# EAGLE design MCon_v1 (EAGLE 9.6.2)
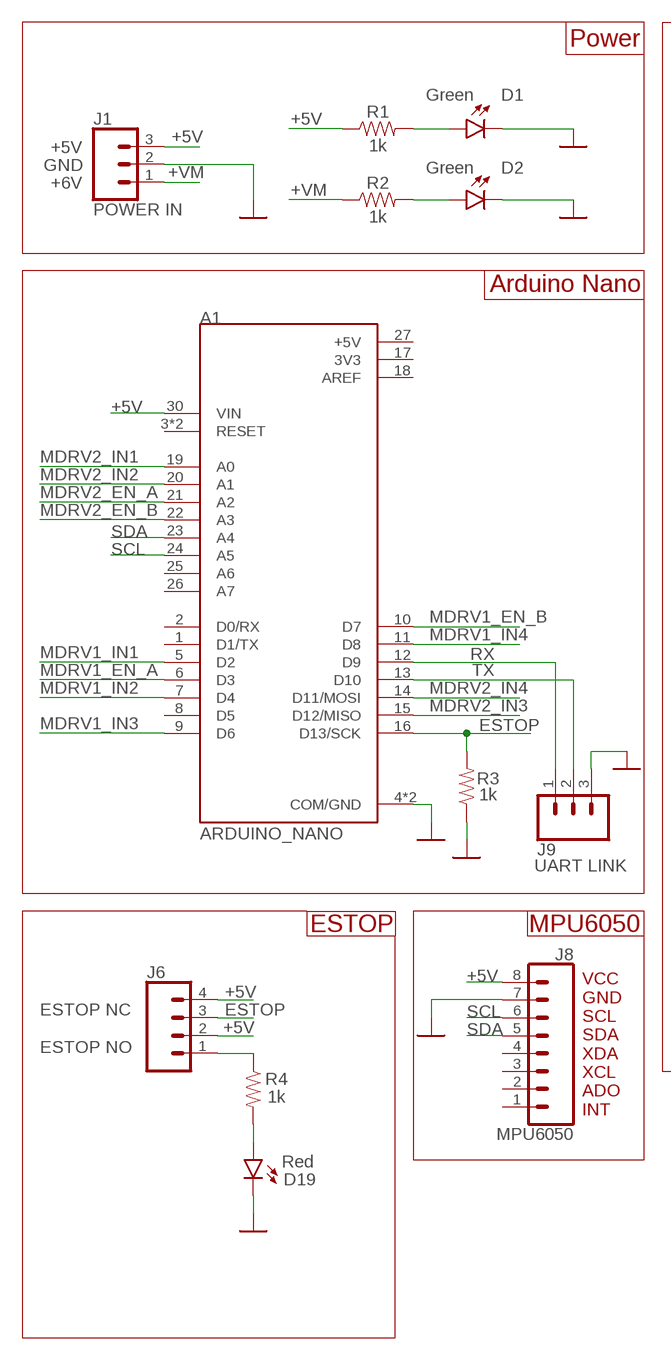
[diagram p0: schematic, sheet 1, part 1 of 2]
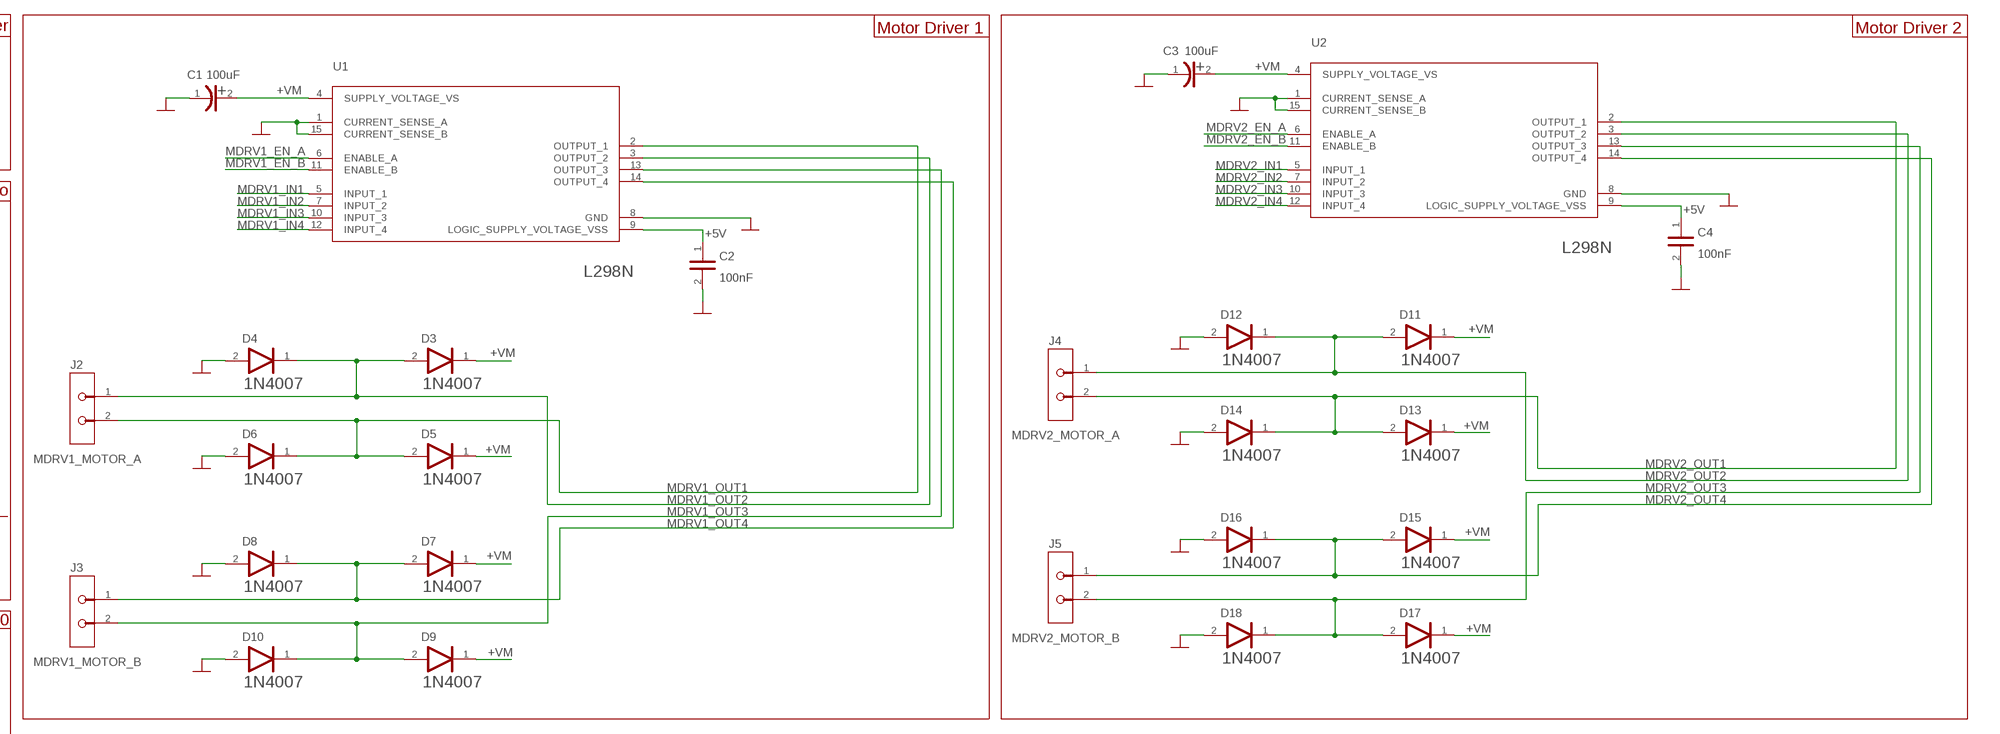
[diagram p1: schematic, sheet 1, part 2 of 2]

## Parts
A1  ARDUINO_NANO  [SHIELD_ARDUINO_NANO]
C1  100uF  PANASONIC_EEU-FR1C101PANASONIC_EEU-FR1C101_0_0  [PANASONIC_EEU-FR1C101_0]
C2  100nF  AVX_CK05BX104KAVX_CK05BX104K_0_0  [AVX_CK05BX104K_0]
C3  100uF  PANASONIC_EEU-FR1C101PANASONIC_EEU-FR1C101_0_0  [PANASONIC_EEU-FR1C101_0]
C4  100nF  AVX_CK05BX104KAVX_CK05BX104K_0_0  [AVX_CK05BX104K_0]
D1  Green  LED3MM  [LED_3MM]
D2  Green  LED3MM  [LED_3MM]
D3  DIOTEC_1N4007DIOTEC_1N4007_0_0  [DIOTEC_1N4007_0]
D4  DIOTEC_1N4007DIOTEC_1N4007_0_0  [DIOTEC_1N4007_0]
D5  DIOTEC_1N4007DIOTEC_1N4007_0_0  [DIOTEC_1N4007_0]
D6  DIOTEC_1N4007DIOTEC_1N4007_0_0  [DIOTEC_1N4007_0]
D7  DIOTEC_1N4007DIOTEC_1N4007_0_0  [DIOTEC_1N4007_0]
D8  DIOTEC_1N4007DIOTEC_1N4007_0_0  [DIOTEC_1N4007_0]
D9  DIOTEC_1N4007DIOTEC_1N4007_0_0  [DIOTEC_1N4007_0]
D10  DIOTEC_1N4007DIOTEC_1N4007_0_0  [DIOTEC_1N4007_0]
D11  DIOTEC_1N4007DIOTEC_1N4007_0_0  [DIOTEC_1N4007_0]
D12  DIOTEC_1N4007DIOTEC_1N4007_0_0  [DIOTEC_1N4007_0]
D13  DIOTEC_1N4007DIOTEC_1N4007_0_0  [DIOTEC_1N4007_0]
D14  DIOTEC_1N4007DIOTEC_1N4007_0_0  [DIOTEC_1N4007_0]
D15  DIOTEC_1N4007DIOTEC_1N4007_0_0  [DIOTEC_1N4007_0]
D16  DIOTEC_1N4007DIOTEC_1N4007_0_0  [DIOTEC_1N4007_0]
D17  DIOTEC_1N4007DIOTEC_1N4007_0_0  [DIOTEC_1N4007_0]
D18  DIOTEC_1N4007DIOTEC_1N4007_0_0  [DIOTEC_1N4007_0]
D19  Red  LED3MM  [LED_3MM]
J1  POWER IN  CONN_03  [1X03]
J2  MDRV1_MOTOR_A  TE_282837-2TE_282837-2_0_0  [TE_282837-2_0]
J3  MDRV1_MOTOR_B  TE_282837-2TE_282837-2_0_0  [TE_282837-2_0]
J4  MDRV2_MOTOR_A  TE_282837-2TE_282837-2_0_0  [TE_282837-2_0]
J5  MDRV2_MOTOR_B  TE_282837-2TE_282837-2_0_0  [TE_282837-2_0]
J6  CONN_04PTH  [1X04]
J8  MPU6050  CONN_08"  [1X08]
J9  UART LINK  CONN_03  [1X03]
R1  1k  RESISTORAXIAL-0.3  [AXIAL-0.3]
R2  1k  RESISTORAXIAL-0.3  [AXIAL-0.3]
R3  1k  RESISTORAXIAL-0.3  [AXIAL-0.3]
R4  1k  RESISTORAXIAL-0.3  [AXIAL-0.3]
U1  STMICROELECTRONICS_L298NSTMICROELECTRONICS_L298N_0_0  [STMICROELECTRONICS_L298N_0]
U2  STMICROELECTRONICS_L298NSTMICROELECTRONICS_L298N_0_0  [STMICROELECTRONICS_L298N_0]

## Nets
+5V: A1.30(VIN) C2.1 C4.1 J1.3 J6.2 J6.4 J8.8 R1.P$1 U1.9(LOGIC_SUPPLY_VOLTAGE_VSS) U2.9(LOGIC_SUPPLY_VOLTAGE_VSS)
+VM: C1.2(ANODE) C3.2(ANODE) D3.1(CATHODE) D5.1(CATHODE) D7.1(CATHODE) D9.1(CATHODE) D11.1(CATHODE) D13.1(CATHODE) D15.1(CATHODE) D17.1(CATHODE) J1.1 R2.P$1 U1.4(SUPPLY_VOLTAGE_VS) U2.4(SUPPLY_VOLTAGE_VS)
ESTOP: A1.16(D13/SCK) J6.3 R3.P$2
GND: A1.4(COM/GND) A1.29(COM/GND) C1.1(CATHODE) C2.2 C3.1(CATHODE) C4.2 D1.K(C) D2.K(C) D4.2(ANODE) D6.2(ANODE) D8.2(ANODE) D10.2(ANODE) D12.2(ANODE) D14.2(ANODE) D16.2(ANODE) D18.2(ANODE) D19.K(C) J1.2 J8.7 J9.3 R3.P$1 U1.1(CURRENT_SENSE_A) U1.8(GND) U1.15(CURRENT_SENSE_B) U2.1(CURRENT_SENSE_A) U2.8(GND) U2.15(CURRENT_SENSE_B) ; supply symbol labelled DGND
MDRV1_EN_A: A1.6(D3) U1.6(ENABLE_A)
MDRV1_EN_B: A1.10(D7) U1.11(ENABLE_B)
MDRV1_IN1: A1.5(D2) U1.5(INPUT_1)
MDRV1_IN2: A1.7(D4) U1.7(INPUT_2)
MDRV1_IN3: A1.9(D6) U1.10(INPUT_3)
MDRV1_IN4: A1.11(D8) U1.12(INPUT_4)
MDRV1_OUT1: D5.2(ANODE) D6.1(CATHODE) J2.2 U1.2(OUTPUT_1)
MDRV1_OUT2: D3.2(ANODE) D4.1(CATHODE) J2.1 U1.3(OUTPUT_2)
MDRV1_OUT3: D9.2(ANODE) D10.1(CATHODE) J3.2 U1.13(OUTPUT_3)
MDRV1_OUT4: D7.2(ANODE) D8.1(CATHODE) J3.1 U1.14(OUTPUT_4)
MDRV2_EN_A: A1.21(A2) U2.6(ENABLE_A)
MDRV2_EN_B: A1.22(A3) U2.11(ENABLE_B)
MDRV2_IN1: A1.19(A0) U2.5(INPUT_1)
MDRV2_IN2: A1.20(A1) U2.7(INPUT_2)
MDRV2_IN3: A1.15(D12/MISO) U2.10(INPUT_3)
MDRV2_IN4: A1.14(D11/MOSI) U2.12(INPUT_4)
MDRV2_OUT1: D13.2(ANODE) D14.1(CATHODE) J4.2 U2.2(OUTPUT_1)
MDRV2_OUT2: D11.2(ANODE) D12.1(CATHODE) J4.1 U2.3(OUTPUT_2)
MDRV2_OUT3: D17.2(ANODE) D18.1(CATHODE) J5.2 U2.13(OUTPUT_3)
MDRV2_OUT4: D15.2(ANODE) D16.1(CATHODE) J5.1 U2.14(OUTPUT_4)
N$1: D1.A R1.P$2
N$2: D2.A R2.P$2
N$3: J6.1 R4.P$1
N$4: D19.A R4.P$2
RX: A1.12(D9) J9.1
SCL: A1.24(A5) J8.6
SDA: A1.23(A4) J8.5
TX: A1.13(D10) J9.2
Unconnected: A1.1(D1/TX) A1.2(D0/RX) A1.3(RESET) A1.8(D5) A1.25(A6) A1.26(A7) A1.28(RESET) J8.1 J8.2 J8.3 J8.4

## Notes on the sheet
- Power | Motor Driver 1 | Motor Driver 2
- +5V
- GND
- +6V
- Arduino Nano
- ESTOP | MPU6050
- ESTOP NC
  
  ESTOP NO
- VCC
  GND
  SCL
  SDA
  XDA
  XCL
  ADO
  INT

## Power pins joined to a net without a drawn wire
3V3: A1.17(3V3)
+5V: A1.27(+5V)
AREF: A1.18(AREF)

## Library data of the parts
A1 = ARDUINO_NANO:ARDUINO_NANO: Arduino Nano, Through Hole Check prices <https://pricing.snapeda.com/parts/ARDUINO%20NANO/Arduino/view-part?ref=eda>; AVAILABILITY: In Stock; DESCRIPTION: ATmega4809 Arduino Nano Every with Headers AVR® AVR MCU 8-Bit Embedded Evaluation Board; MF: Arduino; MP: ARDUINO NANO; PACKAGE: None; PRICE: None
C1 C3 = RMDrv_100uF_FilCap_16SEPC100M:PANASONIC_EEU-FR1C101: Aluminum Electrolytic Capacitors (Radial Lead Type); CAPACITANCE: 100.0µF; CENTROID_NOT_SPECIFIED: No; DATASHEET: https://industrial.panasonic.com/cdbs/www-data/pdf/RDF0000/ABA0000C1259.pdf; DIGIKEY_DESCRIPTION: CAP 100µF 16V Aluminum Electrolytic Capacitors Radial, Can 5000 Hrs @ 105°C; DIGIKEY_PART_NUMBER: P14391-ND; LEAD_FREE: yes; MF: Panasonic; MOUSER_PART_NUMBER: 667-EEU-FR1C101; MPN: EEU-FR1C101; PACKAGE: RADIAL; PREFIX: C; ROHS: yes; TEMPERATURE_RANGE_HIGH: +105°C; TEMPERATURE_RANGE_LOW: 40°C; VOLTAGE: 16V
C2 C4 = RMDrv_0.1uF_FilCap_CK05BX104K:AVX_CK05BX104K: Multilayer Ceramic Capacitors; CAPACITANCE: 100.0nF; CENTROID_NOT_SPECIFIED: Yes; DATASHEET: http://datasheets.avx.com/CK05-06.pdf; DIGIKEY_DESCRIPTION: CAP 0.10µF ±10% 50V Ceramic Capacitor BX Radial; DIGIKEY_PART_NUMBER: 1010-1198-ND; IMPORTED_FROM: octopart; IPC_LAND_PATTERN_NAME: CAPRD508W85D483H483; LEAD_FREE: Unknown; MF: AVX; MOUNTING_TYPE: through hole; MOUSER_PART_NUMBER: 581-CK05BX104K; MPN: CK05BX104K; NUM_PINS: 2; PACKAGE: CAP_SMT_4MM83_2MM29; PREFIX: C; ROHS: Unknown; SYMBOL_0_0: Capacitor; TEMPERATURE_COEFFICIENT: BX; TEMPERATURE_RANGE_HIGH: +125°C; TEMPERATURE_RANGE_LOW: -55°C; TOLERANCE: ±10%; TYPE: capacitor; VOLTAGE: 50V
D1 D2 D19 = SparkFun-LED:LED: LED (Generic) Standard schematic elements and footprints for 5mm, 3mm, 1206, and 0603 sized LEDs. Generic LEDs with no color specified.; PROD_ID: DIO-08794
D3-D18 = 1N4007:DIOTEC_1N4007: Rectifier diode 1000 V 1 A DO-41, ,; AUTOMOTIVE: No; CAPACITANCE: 15pF; CENTROID_NOT_SPECIFIED: No; DATASHEET: https://datasheet.octopart.com/1N4007-Diotec-datasheet-62346875.pdf; DEVICE_CLASS_L1: Discrete Semiconductors; DEVICE_CLASS_L2: Diodes; DEVICE_CLASS_L3: Rectifier Diodes; FOOTPRINT_PARAMETERS_0: {"fp_type":"Axial","params":{"N":{"long name":"Number of leads","type":"fixed","short name":"N","value":2},"L":{"nom":false,"long name":"Package length","min":false,"max":5200000,"short name":"L","type":"measurement"},"D":{"nom":false,"long name":"Package diameter","min":false,"max":2800000,"short name":"D","type":"measurement"},"d":{"nom":770000,"long name":"Lead diameter","min":700000,"max":840000,"short name":"d","type":"measurement"},"e":{"nom":8880000,"long name":"Lead spacing","min":null,"max":null,"short name":"e","type":"measurement"},"P":{"default":"false","long name":"Polarized","type":"multichoice","short name":"P"},"offset x":{"nom":0,"long name":"X Center offset","min":null,"max":null,"short name":"offset x","type":"measurement"},"offset y":{"nom":0,"long name":"Y Center offset","min":null,"max":null,"short name":"offset y","type":"measurement"},"LS":{"default":"Circle","long name":"Land shape","type":"multichoice","short name":"LS"},"LS1":{"default":"Square","long name":"Land shape (Pin 1)","type":"multichoice","short name":"LS1"}}}; FOOTPRINT_VARIANT_NAME_0: Recommended_Land_Pattern; FORWARD_CURRENT: 1A; HEIGHT: 2.8mm; IPC_LAND_PATTERN_NAME: DIOAD888W100L520D280; LEAD_FREE: Yes; MAX_JUNCTION_TEMP: +175°C; MAX_REPETITIVE_REVERSE_VOLTAGE: 1000V; MAX_SURGE_FORWARD_CURRENT: 27A; MF: Diotec; MFG_PACKAGE_IDENT: 1N4007; MFG_PACKAGE_IDENT_DATE: 0; MFG_PACKAGE_IDENT_REV: 0; MPN: 1N4007; PACKAGE: AXIAL; PEAK_REVERSE_CURRENT: 5uA; PREFIX: D; REVERSE_VOLTAGE: 1000V; ROHS: Yes; TEMPERATURE_RANGE_HIGH: +175°C; TEMPERATURE_RANGE_LOW: -50°C; VERIFICATION_VERSION: 0.0.0.3
J1 J9 = SparkFun-Connectors:CONN_03: Multi connection point. Often used as Generic Header-pin footprint for 0.1 inch spaced/style header connections On any of the 0.1 inch spaced packages, you can populate with these: Break Away Headers - Straight <https://www.sparkfun.com/products/116> (PRT-00116) Break Away Male Headers - Right Angle <https://www.sparkfun.com/products/553> (PRT-00553) Female Headers <https://www.sparkfun.com/products/115> (PRT-00115) Break Away Headers - Machine Pin <https://www.sparkfun.com/products/117> (PRT-00117) Break Away Female Headers - Swiss Machine Pin <https://www.sparkfun.com/products/743> (PRT-00743) Stackable Header - 3 Pin (Female, 0.1") <https://www.sparkfun.com/products/13875> (PRT-13875) For SCREWTERMINALS and SPRING TERMINALS visit here: Screw Terimnals on SparkFun.com <https://www.sparkfun.com/search/results?term=Screw+Terminals> (5mm/3.5mm/2.54mm spacing) This device is also useful as a general connection point to wire up your design to another part of your project. Our various solder wires solder well into these plated through hole pads. Hook-Up Wire - Assortment (Stranded, 22 AWG) <https://www.sparkfun.com/products/11375> (PRT-11375) Hook-Up Wire - Assortment (Solid Core, 22 AWG) <https://www.sparkfun.com/products/11367> (PRT-11367) View the entire wire category on our website here <https://www.sparkfun.com/categories/141> Special notes: Molex polarized connector foot print use with SKU : PRT-08232 with associated crimp pins and housings.; PROD_ID: XXX-00000; VALUE: 455-1750-1-ND
J2-J5 = RMDrv_FinalNew_Conn_Terminal:TE_282837-2: Conn Terminal Blocks F 2 POS 5.08mm Solder ST Thru-Hole 13.5A/Contact; CENTROID_NOT_SPECIFIED: No; CONN_GENDER: Female; CONN_ORIENTATION: Horizontal; CONTACT_MATERIAL: Tin; CURRENT_RATING: 13.5A; DATASHEET: https://www.te.com/commerce/DocumentDelivery/DDEController?Action=showdoc&DocId=Catalog+Section%7F1308389_EUROSTYLE_TERMINAL_BLOCKS%7F0607%7Fpdf%7FEnglish%7FENG_CS_1308389_EUROSTYLE_TERMINAL_BLOCKS_0607.pdf%7F282837-2; DEVICE_CLASS_L1: Connectors; DEVICE_CLASS_L2: Terminal Blocks | Terminals; DEVICE_CLASS_L3: unset; DIGIKEY_DESCRIPTION: CONN TERM BLOCK 5.08MM 2POS SIDE ENTY; DIGIKEY_PART_NUMBER: A113320-ND; FOOTPRINT_URL: https://www.te.com/commerce/DocumentDelivery/DDEController?Action=showdoc&DocId=Customer+Drawing%7F282837%7FH%7Fpdf%7FEnglish%7FENG_CD_282837_H.pdf%7F282837-2; HEIGHT: 10.3mm; IS_FEMALE: yes; LEAD_FREE: yes; MAX_WIRE_GAUGE: 16; MF: TE; MFG_PACKAGE_IDENT: 282837-2; MFG_PACKAGE_IDENT_DATE: 0; MFG_PACKAGE_IDENT_REV: 0; MIN_WIRE_GAUGE: 30; MOUSER_DESCRIPTION: Fixed Terminal Blocks 5.08MM PCB MOUNT 2P; MOUSER_PART_NUMBER: 571-2828372; MPN: 282837-2; NUMBER_OF_CONTACTS: 2; NUMBER_OF_ROWS: 1; PACKAGE: HDR2; PREFIX: J; ROHS: yes; TEMPERATURE_RANGE_HIGH: +110°C; TEMPERATURE_RANGE_LOW: -40°C; VERIFICATION_VERSION: 0.0.0.1; VOLTAGE_RATING: 300V
J6 = SparkFun-Connectors:CONN_04: Multi connection point. Often used as Generic Header-pin footprint for 0.1 inch spaced/style header connections On any of the 0.1 inch spaced packages, you can populate with these: Break Away Headers - Straight <https://www.sparkfun.com/products/116> (PRT-00116) Break Away Male Headers - Right Angle <https://www.sparkfun.com/products/553> (PRT-00553) Female Headers <https://www.sparkfun.com/products/115> (PRT-00115) Break Away Headers - Machine Pin <https://www.sparkfun.com/products/117> (PRT-00117) Break Away Female Headers - Swiss Machine Pin <https://www.sparkfun.com/products/743> (PRT-00743) For SCREWTERMINALS and SPRING TERMINALS visit here: Screw Terimnals on SparkFun.com <https://www.sparkfun.com/search/results?term=Screw+Terminals> (5mm/3.5mm/2.54mm spacing) This device is also useful as a general connection point to wire up your design to another part of your project. Our various solder wires solder well into these plated through hole pads. Hook-Up Wire - Assortment (Stranded, 22 AWG) <https://www.sparkfun.com/products/11375> (PRT-11375) Hook-Up Wire - Assortment (Solid Core, 22 AWG) <https://www.sparkfun.com/products/11367> (PRT-11367) View the entire wire category on our website here <https://www.sparkfun.com/categories/141> Special notes: Molex polarized connector foot print use with SKU : PRT-08231 with associated crimp pins and housings. 1MM SMD Version SKU: PRT-10208; PROD_ID: CONN-09696
J8 = SparkFun-Connectors:CONN_08: Multi connection point. Often used as Generic Header-pin footprint for 0.1 inch spaced/style header connections On any of the 0.1 inch spaced packages, you can populate with these: Break Away Headers - Straight <https://www.sparkfun.com/products/116> (PRT-00116) Break Away Male Headers - Right Angle <https://www.sparkfun.com/products/553> (PRT-00553) Female Headers <https://www.sparkfun.com/products/115> (PRT-00115) Break Away Headers - Machine Pin <https://www.sparkfun.com/products/117> (PRT-00117) Break Away Female Headers - Swiss Machine Pin <https://www.sparkfun.com/products/743> (PRT-00743) Arduino Stackable Header - 8 Pin <https://www.sparkfun.com/products/9279> (PRT-09279) For SCREWTERMINALS and SPRING TERMINALS visit here: Screw Terimnals on SparkFun.com <https://www.sparkfun.com/search/results?term=Screw+Terminals> (5mm/3.5mm/2.54mm spacing) This device is also useful as a general connection point to wire up your design to another part of your project. Our various solder wires solder well into these plated through hole pads. Hook-Up Wire - Assortment (Stranded, 22 AWG) <https://www.sparkfun.com/products/11375> (PRT-11375) Hook-Up Wire - Assortment (Solid Core, 22 AWG) <https://www.sparkfun.com/products/11367> (PRT-11367) View the entire wire category on our website here <https://www.sparkfun.com/categories/141> Special notes: Molex polarized connector foot print use with SKU : PRT-08231 with associated crimp pins and housings. 1MM SMD Version SKU: PRT-10208 NOTES ON THE VARIANTS LOCK and LOCK_LONGPADS... This footprint was designed to help hold the alignment of a through-hole component (i.e. 6-pin header) while soldering it into place. You may notice that each hole has been shifted either up or down by 0.005 of an inch from it's more standard position (which is a perfectly straight line). This slight alteration caused the pins (the squares in the middle) to touch the edges of the holes. Because they are alternating, it causes a "brace" to hold the component in place. 0.005 has proven to be the perfect amount of "off-center" position when using our standard breakaway headers. Although looks a little odd when you look at the bare footprint, once you have a header in there, the alteration is very hard to notice. Also,if you push a header all the way into place, it is covered up entirely on the bottom side.; PROD_ID: CONN-08438
R1-R4 = SparkFun-Resistors:RESISTOR: Generic Resistor Package
U1 U2 = RMDrv_L298N:STMICROELECTRONICS_L298N: L298N DUAL FULL-BRIDGE DRIVER; CENTROID_NOT_SPECIFIED: No; DATASHEET: https://upverter.com/datasheet/4e6acc8e34692b9176918ad45905b166727b88f4.pdf; DIGIKEY_DESCRIPTION: IC BRIDGE DRIVER PAR 15MULTIWATT; DIGIKEY_PART_NUMBER: 497-1395-5-ND; IMPORTED_FROM: octopart; LEAD_FREE: yes; MAX_SUPPLY_VOLTAGE_DC: 46V; MF: STMicroelectronics; MOUNTING_TYPE: Through Hole; MOUSER_PART_NUMBER: 511-L298; MPN: L298N; NUM_PINS: 13; OCTOPART_PART_NUMBER: 8e8a47878f08514d; OUTPUT_CURRENT: 2A; OUTPUT_VOLTAGE: 46V; PACKAGE: Multiwatt15 Vertical; PREFIX: U; ROHS: yes; SYMBOL_0_0: Standard; TEMPERATURE_RANGE_HIGH: +150°C; TEMPERATURE_RANGE_LOW: -40°C; TYPE: integrated circuit

## Board
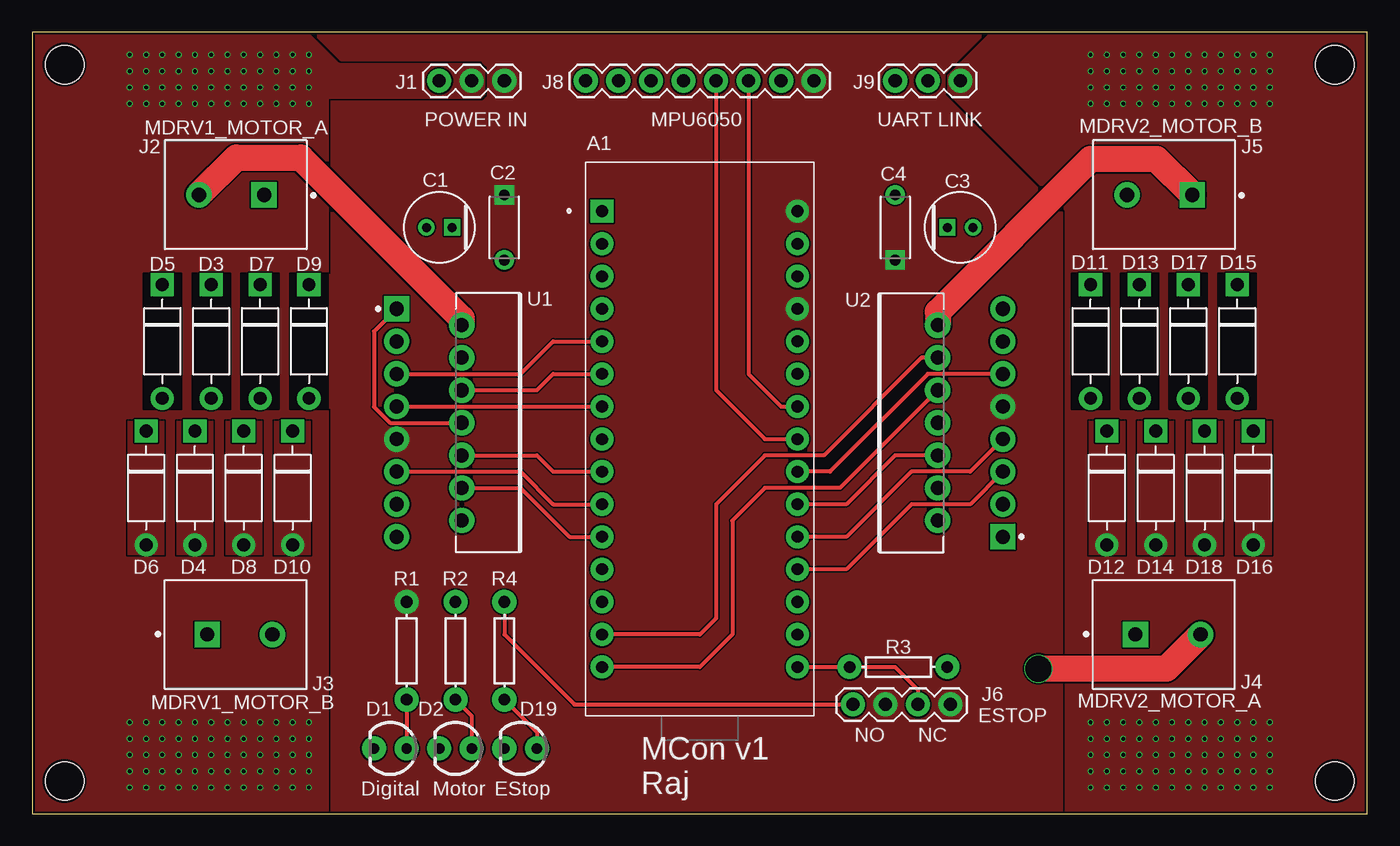
[diagram p2: board, top side]
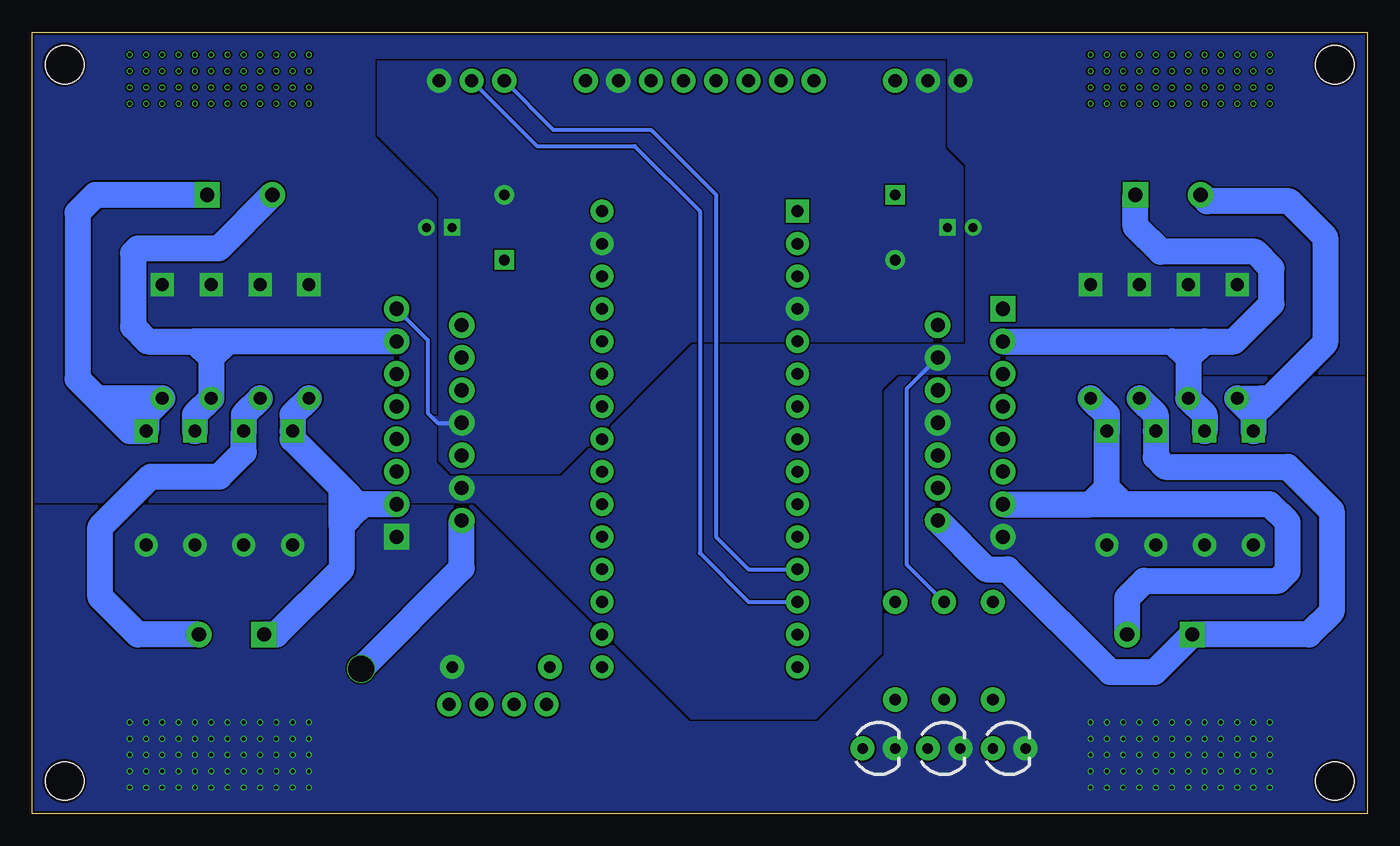
[diagram p3: board, bottom side, seen from below]

Size 104.14 x 60.96 mm. Coordinates in mm from the lower left corner, seen from the top.
Outline: 0,0 104.14,0 104.14,60.96 0,60.96 0,0
Copper layers (1*16): Top 0.035mm / dielectric 1.6mm / Bottom 0.035mm
Design rules "jlcpcb-2layers": minimum track width 5mil, minimum drill 0.3mm, track to track 5mil, track to pad 5mil, pad to pad 5mil, via to via 5mil, smd to smd 5mil, copper to edge 0.2mm, drill to drill 6mil, minimum pad ring 10mil, minimum via ring 3mil, stop-mask expansion 4mil, vias tented up to drill 0mil, thermal gap 10mil
Holes 3 mm at 2.54,58.42 2.54,2.54 101.6,2.54 101.6,58.42

### Footprints (pad centres in the part's own frame; a part is rotated, then mirrored left to right if it is on the bottom)
SHIELD_ARDUINO_NANO = drill 0.9 pad 1.8 square: 1 -7.62,17.78 | drill 0.9 pad 1.8: 2 -7.62,15.24; 3 -7.62,12.7; 4 -7.62,10.16; 5 -7.62,7.62; 6 -7.62,5.08; 7 -7.62,2.54; 8 -7.62,0; 9 -7.62,-2.54; 10 -7.62,-5.08; 11 -7.62,-7.62; 12 -7.62,-10.16; 13 -7.62,-12.7; 14 -7.62,-15.24; 15 -7.62,-17.78; 16 7.62,-17.78; 17 7.62,-15.24; 18 7.62,-12.7; 19 7.62,-10.16; 20 7.62,-7.62; 21 7.62,-5.08; 22 7.62,-2.54; 23 7.62,0; 24 7.62,2.54; 25 7.62,5.08; 26 7.62,7.62; 27 7.62,10.16; 28 7.62,12.7; 29 7.62,15.24; 30 7.62,17.78
PANASONIC_EEU-FR1C101_0 = drill 0.7 pad 1.2 square: 1 -1,0 | drill 0.7 pad 1.2: 2 1,0
AVX_CK05BX104K_0 = drill 0.85 pad 1.35 square: 1 -2.54,0 | drill 0.85 pad 1.35: 2 2.54,0
LED_3MM = drill 0.813 pad 1.88: A -1.27,0; K 1.27,0
DIOTEC_1N4007_0 = drill 1 pad 1.55 square: 1 -4.44,0 | drill 1 pad 1.55: 2 4.44,0
1X03 = drill 1.016 pad 1.88: 1 0,0; 2 2.54,0; 3 5.08,0
TE_282837-2_0 = drill 1.1 pad 1.7 square: 1 -2.215,0 | drill 1.1 pad 1.7: 2 2.865,0
1X04 = drill 1.016 pad 1.88: 1 0,0; 2 2.54,0; 3 5.08,0; 4 7.62,0
1X08 = drill 1.016 pad 1.88: 1 0,0; 2 2.54,0; 3 5.08,0; 4 7.62,0; 5 10.16,0; 6 12.7,0; 7 15.24,0; 8 17.78,0
AXIAL-0.3 = drill 0.9 pad 1.88: P$1 -3.81,0; P$2 3.81,0
STMICROELECTRONICS_L298N_0 = drill 1.1 pad 1.7 square: 1 -8.89,-7.13 | drill 1.1 pad 1.7: 2 -7.62,-2.05; 3 -6.35,-7.13; 4 -5.08,-2.05; 5 -3.81,-7.13; 6 -2.54,-2.05; 7 -1.27,-7.13; 8 0,-2.05; 9 1.27,-7.13; 10 2.54,-2.05; 11 3.81,-7.13; 12 5.08,-2.05; 13 6.35,-7.13; 14 7.62,-2.05; 15 8.89,-7.13

### Placement (x,y rotation side)
A1  52.07,29.21 0 top
C1  31.75,45.72 180 top
C2  36.83,45.72 270 top
C3  72.39,45.72 0 top
C4  67.31,45.72 90 top
D1  27.94,5.08 180 top
D2  33.02,5.08 180 top
D3  13.97,36.83 270 top
D4  12.7,25.4 270 top
D5  10.16,36.83 270 top
D6  8.89,25.4 270 top
D7  17.78,36.83 270 top
D8  16.51,25.4 270 top
D9  21.59,36.83 270 top
D10  20.32,25.4 270 top
D11  82.55,36.83 270 top
D12  83.82,25.4 270 top
D13  86.36,36.83 270 top
D14  87.63,25.4 270 top
D15  93.98,36.83 270 top
D16  95.25,25.4 270 top
D17  90.17,36.83 270 top
D18  91.44,25.4 270 top
D19  38.1,5.08 180 top
J1  31.75,57.15 0 top
J2  15.88,48.26 180 top
J3  15.88,13.97 0 top
J4  88.27,13.97 0 top
J5  88.27,48.26 180 top
J6  64.01,8.51 0 top
J8  43.18,57.15 0 top
J9  67.31,57.15 0 top
R1  29.21,12.7 270 top
R2  33.02,12.7 270 top
R3  67.56,11.43 180 top
R4  36.83,12.7 270 top
U1  35.56,30.48 270 top
U2  68.58,30.48 90 top

### Tracks (layer width: path | path; a pad name or v marks a point on that pad's centre or on a via)
+5V
  pour Top (rank 2, no thermals): 0,60.83 104.14,60.83 104.14,0.13 0,0.13
+VM
  Bottom 0.305: U1.4 35.94,33.13 35.94,19.43 R2.P$1
  pour Bottom (no thermals): 32.64,60.83 32.64,52.07 31.24,50.67 31.24,36.45 33.91,36.45 34.54,35.81 34.54,34.42 0,34.42 0,60.83
  pour Bottom (no thermals): 104.01,60.96 77.6,60.96 77.6,52.7 73.15,48.26 72.77,47.88 72.77,43.31 72.77,27.3 71.88,26.42 71.63,26.16 70.1,26.16 69.6,25.65 69.6,25.4 69.6,24.64 69.85,24.38 73.28,24.38 104.14,24.38 104.14,60.96
  pour Bottom (no thermals): 32.64,60.83 79.88,60.83 79.88,59.05 31.5,59.05 31.5,60.83 32.51,60.83
  pour Bottom (no thermals): 32.26,36.45 52.58,36.45 61.34,27.69 62.87,26.16 71.63,26.16 72.39,25.4 72.39,25.15 72.39,24.77 72.01,24.38 69.6,24.38 52.71,7.49 43.05,7.49 37.97,12.57 37.97,33.15 36.7,34.42 32,34.42 31.75,34.42 30.99,34.42 30.99,36.45 32,36.45 32.13,36.45
ESTOP
  Top 0.305: A1.16 R3.P$2 67.31,11.43 69.09,9.65 J6.3
GND  (via drill 0.3)
  Top 0.305: U1.1 26.67,37.61 26.67,31.71 27.9,30.48 U1.8
  Bottom 0.305: U2.15 73.28,36.94 73.28,31.24 72.52,30.48 U2.8
  other vias: 21.59,7.11 20.32,7.11 19.05,7.11 17.78,7.11 16.51,7.11 15.24,7.11 13.97,7.11 12.7,7.11 11.43,7.11 10.16,7.11 8.89,7.11 7.62,7.11 7.62,5.84 8.89,5.84 10.16,5.84 11.43,5.84 12.7,5.84 13.97,5.84 15.24,5.84 16.51,5.84 17.78,5.84 19.05,5.84 20.32,5.84 21.59,5.84 21.59,4.57 20.32,4.57 19.05,4.57 17.78,4.57 16.51,4.57 15.24,4.57 13.97,4.57 12.7,4.57 11.43,4.57 10.16,4.57 8.89,4.57 7.62,4.57 7.62,3.3 8.89,3.3 10.16,3.3 11.43,3.3 12.7,3.3 13.97,3.3 15.24,3.3 16.51,3.3 17.78,3.3 19.05,3.3 20.32,3.3 21.59,3.3 21.59,2.03 20.32,2.03 19.05,2.03 17.78,2.03 16.51,2.03 15.24,2.03 13.97,2.03 12.7,2.03 11.43,2.03 10.16,2.03 8.89,2.03 7.62,2.03 96.52,7.11 95.25,7.11 93.98,7.11 92.71,7.11 91.44,7.11 90.17,7.11 88.9,7.11 87.63,7.11 86.36,7.11 85.09,7.11 83.82,7.11 82.55,7.11 82.55,5.84 83.82,5.84 85.09,5.84 86.36,5.84 87.63,5.84 88.9,5.84 90.17,5.84 91.44,5.84 92.71,5.84 93.98,5.84 95.25,5.84 96.52,5.84 96.52,4.57 95.25,4.57 93.98,4.57 92.71,4.57 91.44,4.57 90.17,4.57 88.9,4.57 87.63,4.57 86.36,4.57 85.09,4.57 83.82,4.57 82.55,4.57 82.55,3.3 83.82,3.3 85.09,3.3 86.36,3.3 87.63,3.3 88.9,3.3 90.17,3.3 91.44,3.3 92.71,3.3 93.98,3.3 95.25,3.3 96.52,3.3 96.52,2.03 95.25,2.03 93.98,2.03 92.71,2.03 91.44,2.03 90.17,2.03 88.9,2.03 87.63,2.03 86.36,2.03 85.09,2.03 83.82,2.03 82.55,2.03 96.52,57.91 95.25,57.91 93.98,57.91 92.71,57.91 91.44,57.91 90.17,57.91 88.9,57.91 87.63,57.91 86.36,57.91 85.09,57.91 83.82,57.91 82.55,57.91 82.55,56.64 83.82,56.64 85.09,56.64 86.36,56.64 87.63,56.64 88.9,56.64 90.17,56.64 91.44,56.64 92.71,56.64 93.98,56.64 95.25,56.64 96.52,56.64 96.52,55.37 95.25,55.37 93.98,55.37 92.71,55.37 91.44,55.37 90.17,55.37 88.9,55.37 87.63,55.37 86.36,55.37 85.09,55.37 83.82,55.37 82.55,55.37 21.59,57.91 20.32,57.91 19.05,57.91 17.78,57.91 16.51,57.91 15.24,57.91 13.97,57.91 12.7,57.91 11.43,57.91 10.16,57.91 8.89,57.91 7.62,57.91 7.62,56.64 8.89,56.64 10.16,56.64 11.43,56.64 12.7,56.64 13.97,56.64 15.24,56.64 16.51,56.64 17.78,56.64 19.05,56.64 20.32,56.64 21.59,56.64 21.59,55.37 20.32,55.37 19.05,55.37 17.78,55.37 16.51,55.37 15.24,55.37 13.97,55.37 12.7,55.37 11.43,55.37 10.16,55.37 8.89,55.37 7.62,55.37 96.52,59.18 95.25,59.18 93.98,59.18 92.71,59.18 91.44,59.18 90.17,59.18 88.9,59.18 87.63,59.18 86.36,59.18 85.09,59.18 83.82,59.18 82.55,59.18 21.59,59.18 20.32,59.18 19.05,59.18 17.78,59.18 16.51,59.18 15.24,59.18 13.97,59.18 12.7,59.18 11.43,59.18 10.16,59.18 8.89,59.18 7.62,59.18
  pour Bottom (rank 2, no thermals): -1.27,0 -1.27,62.23 105.41,62.23 105.41,-1.27 -1.27,-1.27
  pour Top (no thermals): 33.78,58.42 34.8,58.42 35.18,58.04 35.18,56.64 35.18,56.13 34.93,55.88 33.91,55.88 26.54,55.88 22.99,55.88 22.99,0.13 0,0.13 0,60.83 21.46,60.83 23.88,58.42
  pour Top (no thermals): 71.5,57.4 71.5,56.26 71.88,55.88 80.64,47.12 80.64,34.42 80.64,0.13 104.14,0.13 104.14,60.83 74.8,60.83 71.5,57.53
MDRV1_EN_A
  Top 0.305: U1.6 39.37,33.02 40.64,34.29 A1.6
MDRV1_EN_B
  Top 0.305: U1.11 38.1,26.67 40.64,24.13 A1.10
MDRV1_IN1
  Top 0.305: U1.5 38.1,34.29 40.64,36.83 A1.5
MDRV1_IN2
  Top 0.305: U1.7 A1.7
MDRV1_IN3
  Top 0.305: A1.9 40.64,26.67 39.37,27.94 U1.10
MDRV1_IN4
  Top 0.305: U1.12 38.1,25.4 41.91,21.59 A1.11
MDRV1_OUT1
  Top 2.032: J2.2 15.93,51.18 20.95,51.18 33.51,38.63 U1.2
  Bottom 2.032: J2.2 12.5,47.75 6.1,47.75 3.3,44.96 3.3,36.71 7.94,32.07 | 8.89,31.12 D5.2 8.26,32.39 7.94,32.07 | 8.89,31.12 D6.1 | 7.94,32.07 8.89,31.12
MDRV1_OUT2
  Bottom 2.032: D4.1 12.7,31.12 D3.2 13.97,35.56 | J2.1 18.09,45.78 16.13,43.81 8.76,43.81 7.49,42.55 7.49,39.75 10.41,36.83 12.7,36.83 | U1.3 15.24,36.83 | 15.24,36.83 13.97,35.56 | 13.97,35.56 12.7,36.83 | 15.24,36.83 12.7,36.83
MDRV1_OUT3
  Bottom 2.032: D9.2 20.32,31.12 D10.1 20.32,25.4 | J3.2 18.74,16.82 17.4,18.16 6.99,18.16 6.22,18.92 6.22,22.73 7.62,24.13 19.05,24.13 | 19.05,24.13 20.32,25.4 | 21.59,24.13 20.32,25.4 | U1.13 21.59,24.13 | 19.05,24.13 21.59,24.13
MDRV1_OUT4
  Bottom 2.032: D7.2 16.51,31.12 D8.1 16.51,27.81 15.75,27.05 6.22,27.05 2.79,23.62 2.79,15.75 4.57,13.97 J3.1 16.58,11.05 20.07,11.05 28.07,19.05 29.7,19.05 U1.14
MDRV2_EN_A
  Top 0.305: A1.21 63.5,24.13 67.31,27.94 U2.6
MDRV2_EN_B
  Top 0.305: U2.11 69.85,34.29 62.23,26.67 A1.22
MDRV2_IN1
  Top 0.305: U2.5 73.17,24.13 68.58,24.13 63.5,19.05 A1.19
MDRV2_IN2
  Top 0.305: U2.7 73.17,26.67 68.58,26.67 63.5,21.59 A1.20
MDRV2_IN3
  Top 0.305: U2.10 63.01,25.4 57.15,25.4 54.61,22.86 54.61,13.97 52.07,11.43 A1.15
MDRV2_IN4
  Top 0.305: U2.12 69.36,35.56 61.74,27.94 57.15,27.94 53.34,24.13 53.34,15.24 52.07,13.97 A1.14
MDRV2_OUT1  (via drill 2.03)
  Top 2.032: J4.2 88.46,11.3 v78.49,11.3
  Bottom 2.032: D13.2 87.63,31.12 D14.1 87.63,28.19 89.53,26.29 94.87,26.29 98.81,22.35 98.81,16.89 95.88,13.97 J4.2 | v78.49,11.3 70.63,19.16 U2.2
MDRV2_OUT2
  Bottom 2.032: D11.2 83.82,31.12 D12.1 83.82,29.21 80.01,25.4 | U2.3 78.74,24.13 | 78.74,24.13 78.74,23.75 80.01,22.48 | 80.01,22.48 80.01,19.05 85.09,13.97 J4.1 | 80.01,25.4 78.74,24.13 | 80.01,22.48 80.01,25.4
MDRV2_OUT3
  Bottom 2.032: D18.1 91.44,31.12 D17.2 90.17,35.56 | J5.2 89.59,44.07 95.88,44.07 96.27,43.69 96.27,37.97 95.12,36.83 91.44,36.83 | 91.44,36.83 90.17,35.56 | 90.17,35.56 88.9,36.83 | U2.13 88.9,36.83 | 88.9,36.83 91.44,36.83
MDRV2_OUT4
  Top 2.032: J5.1 87.69,51.05 82.55,51.05 70.63,39.13 U2.14
  Bottom 2.032: D16.1 95.25,31.12 D15.2 97.8,32.39 | 99.07,32.39 100.58,33.9 100.58,46.86 99.19,48.26 J5.1 | 97.8,32.39 D16.1 | 97.8,32.39 99.07,32.39 | 99.07,32.39 96.52,29.84 D16.1
N$1
  Top 0.305: R1.P$2 D1.A
N$2
  Top 0.305: R2.P$2 34.29,7.62 D2.A
N$3
  Top 0.305: R4.P$1 36.83,13.97 42.29,8.51 J6.1
N$4
  Top 0.305: R4.P$2 39.37,6.35 D19.A
RX
  Bottom 0.305: J9.1 63.5,53.34 55.88,53.34 50.8,48.26 50.8,21.59 48.26,19.05 A1.12
SCL
  Top 0.305: J8.6 55.88,34.29 58.42,31.75 A1.24
SDA
  Top 0.305: J8.5 53.34,33.02 57.15,29.21 A1.23
TX
  Bottom 0.305: J9.2 64.77,52.07 57.15,52.07 52.07,46.99 52.07,20.32 48.26,16.51 A1.13

### Text on the board
tPlace: MDRV1_MOTOR_A | MDRV2_MOTOR_B | MDRV2_MOTOR_A | MDRV1_MOTOR_B | ESTOP | NO | NC | Digital | Motor | EStop | MCon v1 / Raj